# Altium schematic sheet HC-NBIOT_Single_lamp_controller-V1.1.SchDoc
size A2
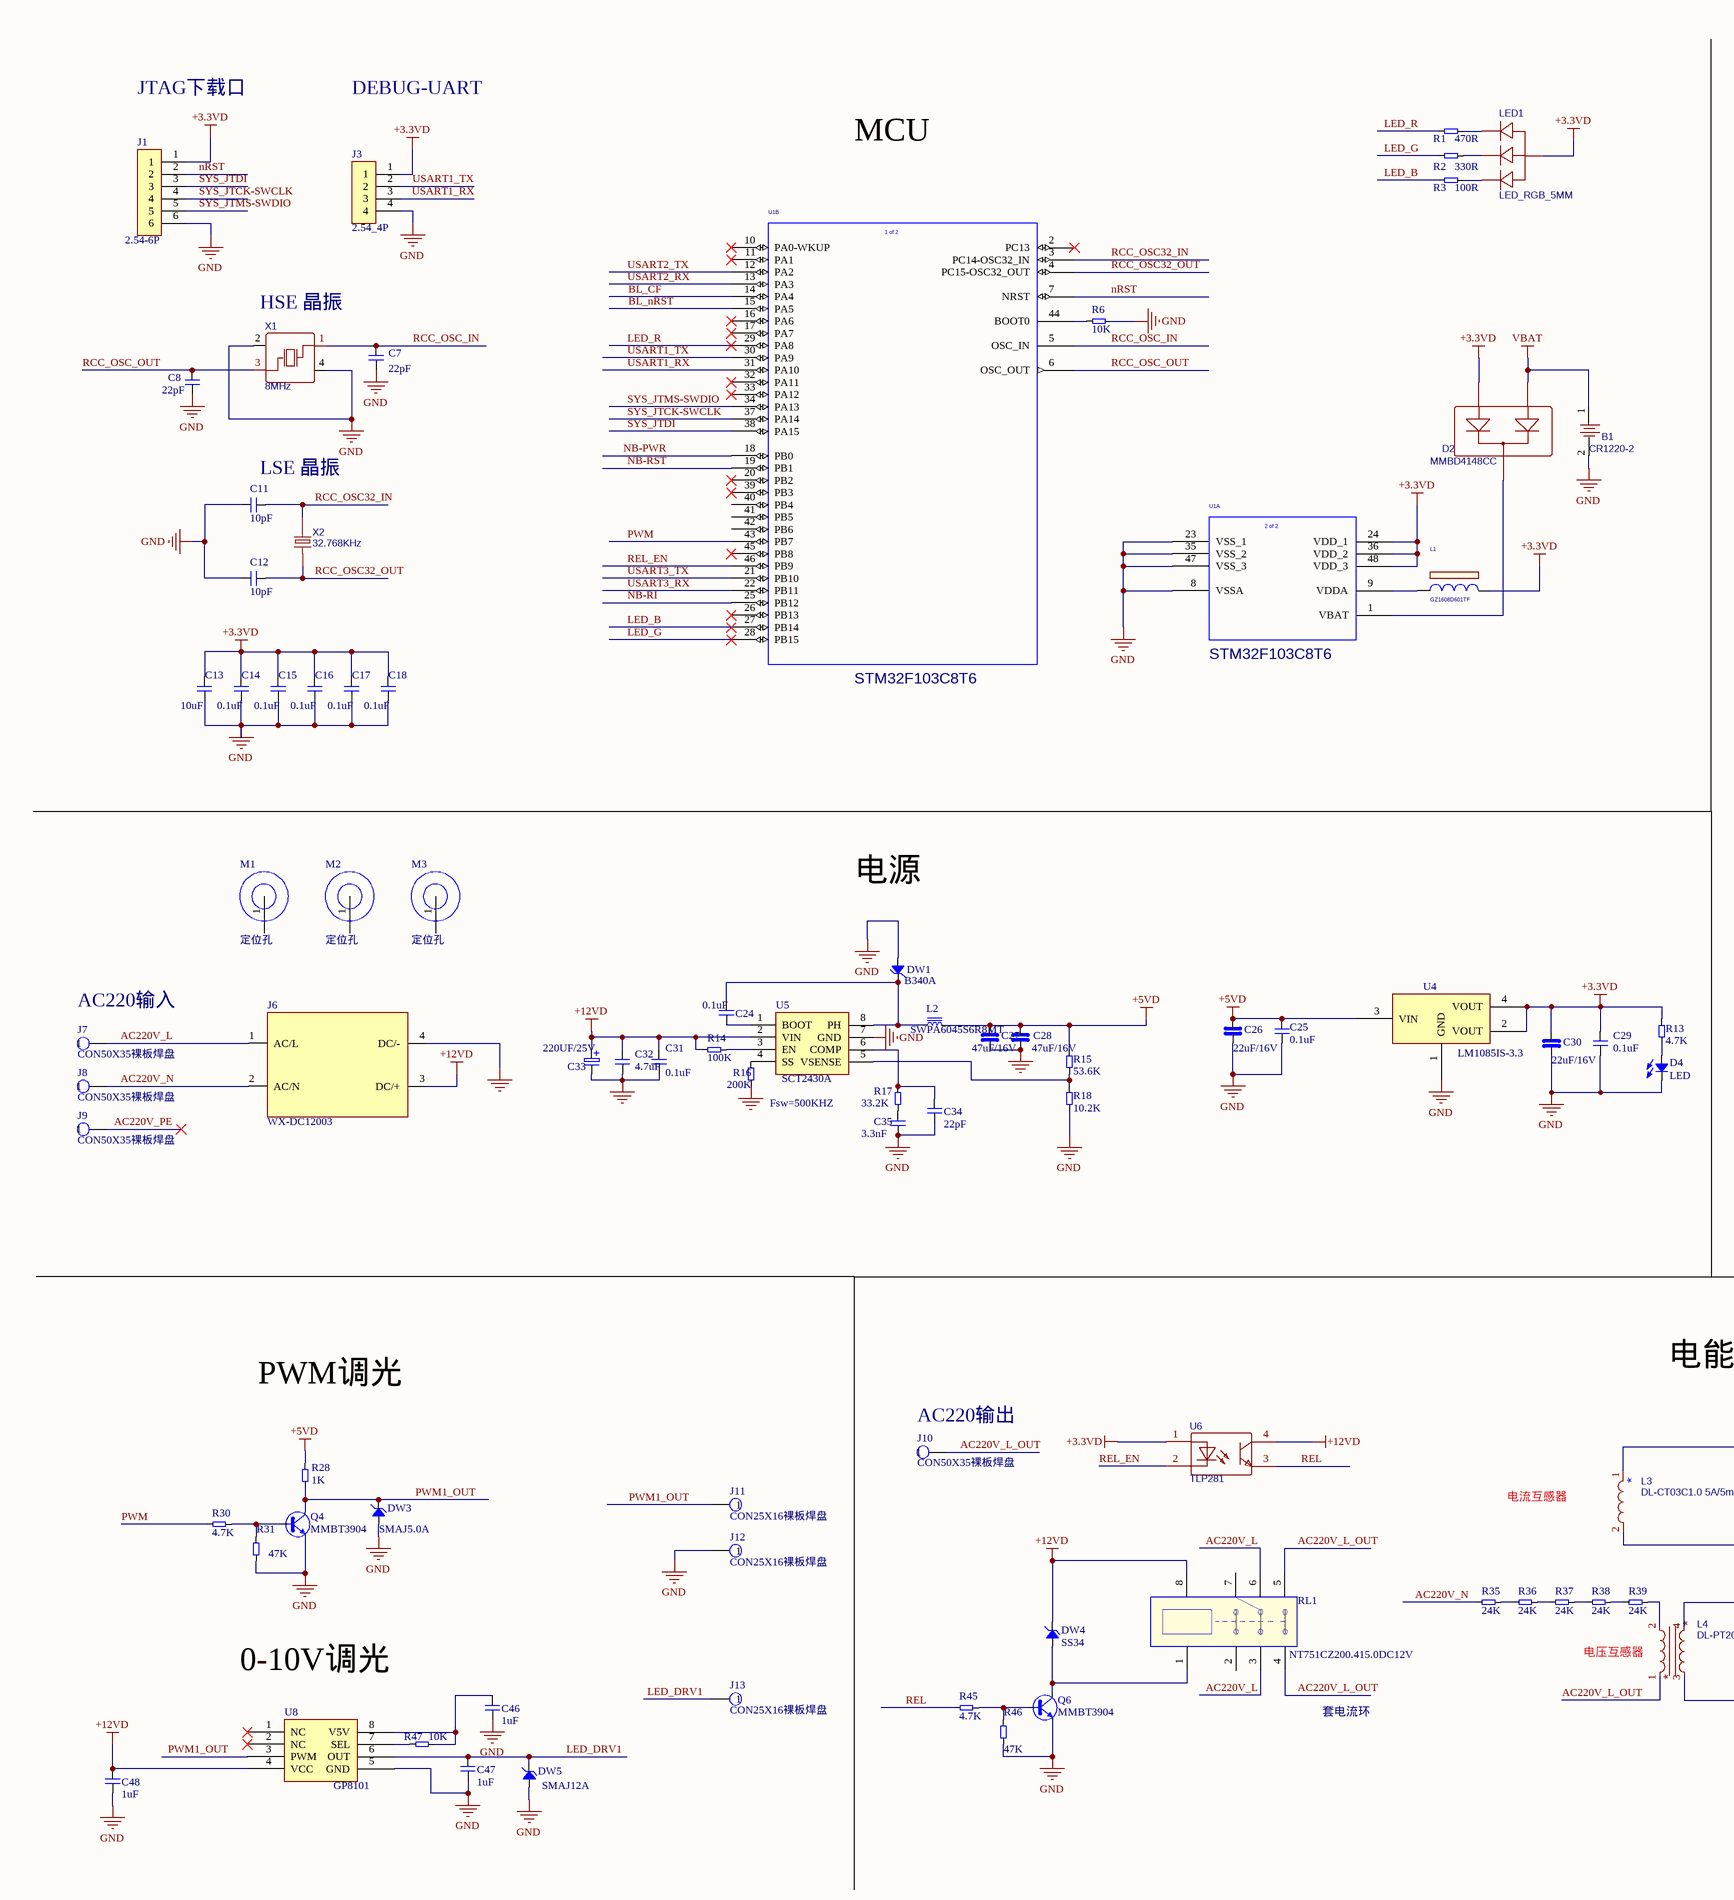
[diagram p0: HC-NBIOT_Single_lamp_controller-V1.1.SchDoc, left]
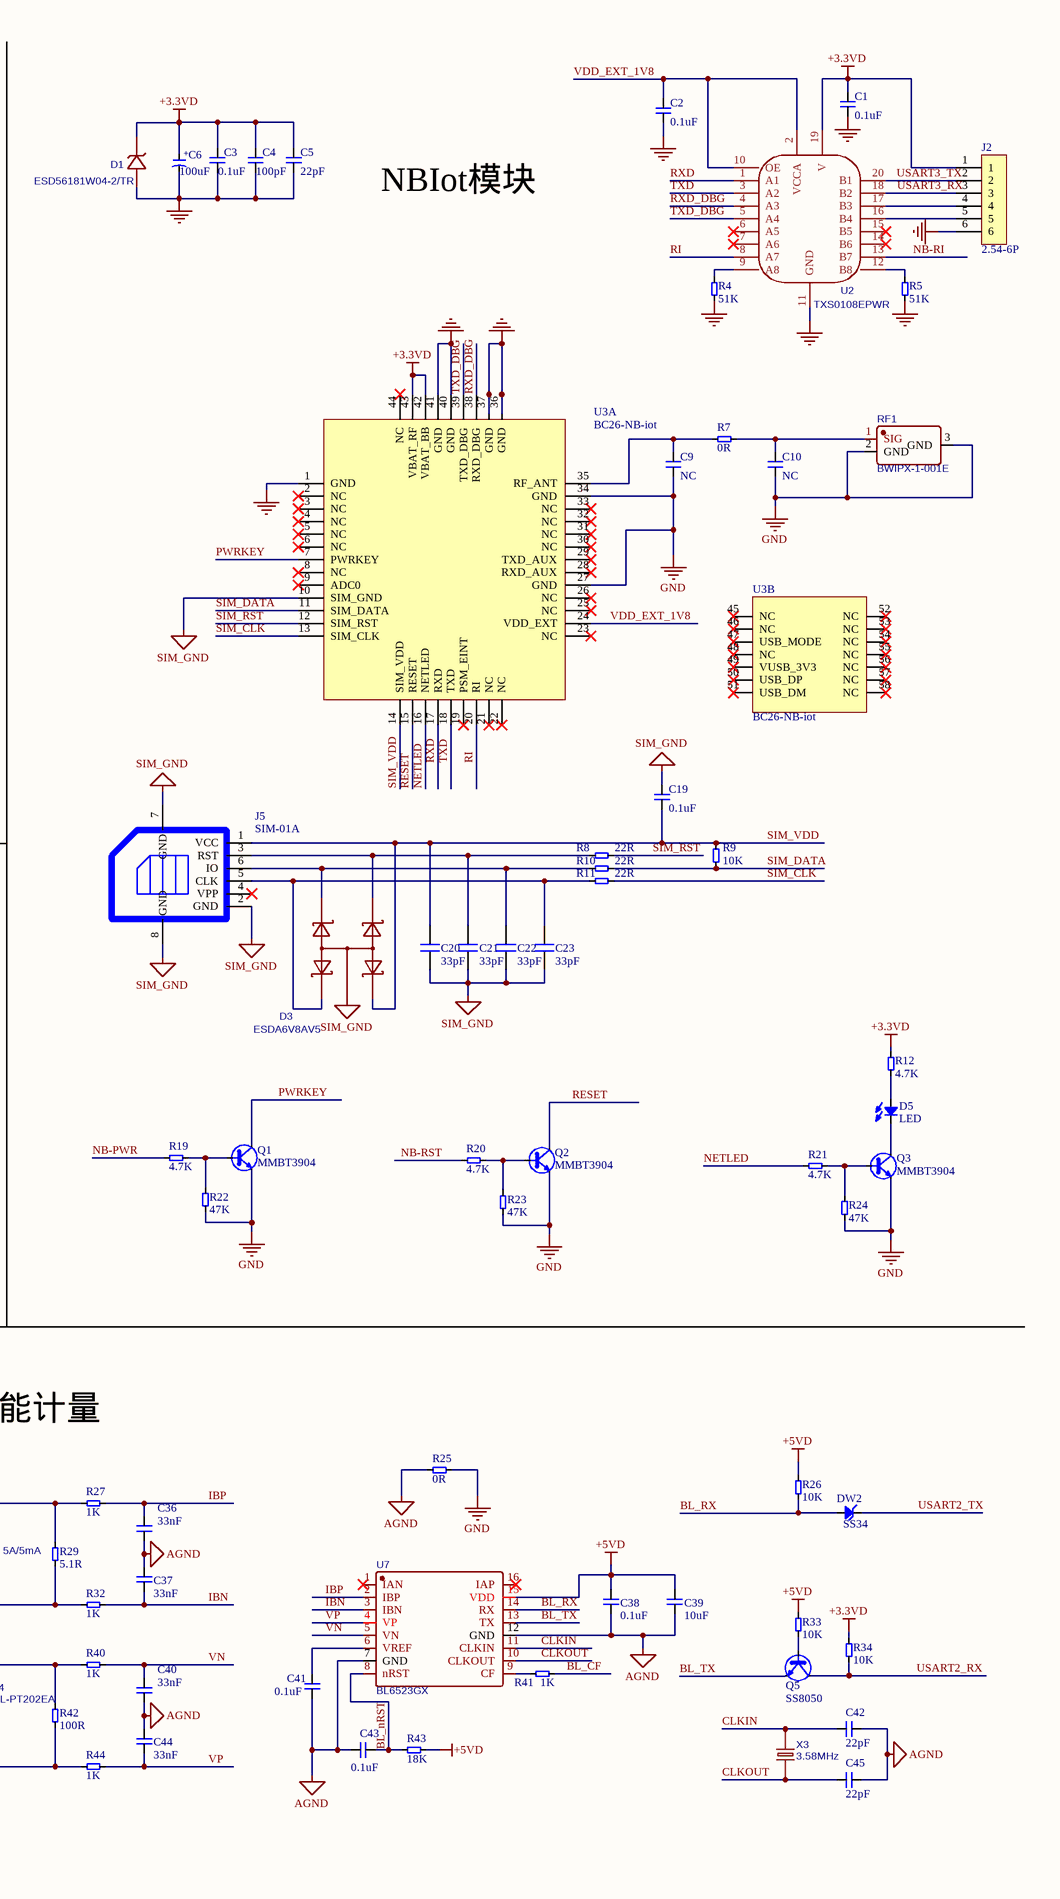
[diagram p1: HC-NBIOT_Single_lamp_controller-V1.1.SchDoc, right]

## Parts
B1  CR1220-2  [BAT-SMD_CR1220-2]
C1  0.1uF  [0603C]
C2  0.1uF  [0603C]
C3  0.1uF  [0603C]
C4  100pF  [0603C]
C5  22pF  [0603C]
C6  100uF  [CAP-SMD_L3.5-W2.8]
C7  22pF  [0603C]
C8  22pF  [0603C]
C9  NC  [0603C]
C10  NC  [0603C]
C11  10pF  [0603C]
C12  10pF  [0603C]
C13  10uF  [1206C]
C14  0.1uF  [0603C]
C15  0.1uF  [0603C]
C16  0.1uF  [0603C]
C17  0.1uF  [0603C]
C18  0.1uF  [0603C]
C19  0.1uF  [0603C]
C20  33pF  [0603C]
C21  33pF  [0603C]
C22  33pF  [0603C]
C23  33pF  [0603C]
C24  0.1uF  [0603C]
C25  0.1uF  [0603C]
C26  22uF/16V  [1206C]
C27  47uF/16V  [1206C]
C28  47uF/16V  [1206C]
C29  0.1uF  [0603C]
C30  22uF/16V  [1206C]
C31  0.1uF  [0603C]
C32  4.7uF  [0603C]
C33  220UF/25V  [RAD-3R8]
C34  22pF  [0603C]
C35  3.3nF  [0603C]
C36  33nF  [0603C]
C37  33nF  [0603C]
C38  0.1uF  [0603C]
C39  10uF  [1206C]
C40  33nF  [0603C]
C41  0.1uF  [0603C]
C42  22pF  [0603C]
C43  0.1uF  [0603C]
C44  33nF  [0603C]
C45  22pF  [0603C]
C46  1uF  [0603C]
C47  1uF  [0603C]
C48  1uF  [0603C]
D1  ESD56181W04-2/TR  [ESD56181W04]
D2  MMBD4148CC  [SOT-23-3]
D3  ESDA6V8AV5  [SOT-553_ESDA6V8AV5]
D4  LED  [LED0603]
D5  LED  [LED0603]
DW1  B340A  [SMB]
DW2  SS34  [SMA]
DW3  SMAJ5.0A  [SMA]
DW4  SS34  [SMA]
DW5  SMAJ12A  [SMA]
J1  2.54-6P  [2.54-6P]
J2  2.54-6P  [2.54-6P]
J3  2.54_4P  [2.54-4P]
J5  SIM-01A  [SIM-01A]
J6  WX-DC12003  [WX-DC12003]
J7  CON50X35裸板焊盘  [SCREW5030]
J8  CON50X35裸板焊盘  [SCREW5030]
J9  CON50X35裸板焊盘  [SCREW5030]
J10  CON50X35裸板焊盘  [SCREW5030]
J11  CON25X16裸板焊盘  [SCREW2516]
J12  CON25X16裸板焊盘  [SCREW2516]
J13  CON25X16裸板焊盘  [SCREW2516]
L1  GZ1608D601TF  [0603L]
L2  SWPA6045S6R8MT  [SDRH6D45]
L3  DL-CT03C1.0 5A/5mA  [DL-CT03C1.0 5A/5mA]
L4  DL-PT202EA  [DL-PT202EA]
LED1  LED_RGB_5MM  [LED_RGB_5MM]
M1  定位孔  [SCREW7035]
M2  定位孔  [SCREW7035]
M3  定位孔  [SCREW7035]
Q1  MMBT3904  [SOT-23]
Q2  MMBT3904  [SOT-23]
Q3  MMBT3904  [SOT-23]
Q4  MMBT3904  [SOT-23]
Q5  SS8050  [SOT-23]
Q6  MMBT3904  [SOT-23]
R1  470R  [0603R]
R2  330R  [0603R]
R3  100R  [0603R]
R4  51K  [0603R]
R5  51K  [0603R]
R6  10K  [0603R]
R7  0R  [0603R]
R8  22R  [0603R]
R9  10K  [0603R]
R10  22R  [0603R]
R11  22R  [0603R]
R12  4.7K  [0603R]
R13  4.7K  [0603R]
R14  100K  [0603R]
R15  53.6K  [0603R]
R16  200K  [0603R]
R17  33.2K  [0603R]
R18  10.2K  [0603R]
R19  4.7K  [0603R]
R20  4.7K  [0603R]
R21  4.7K  [0603R]
R22  47K  [0603R]
R23  47K  [0603R]
R24  47K  [0603R]
R25  0R  [0603R]
R26  10K  [0603R]
R27  1K  [0603R]
R28  1K  [0603R]
R29  5.1R  [0603R]
R30  4.7K  [0603R]
R31  47K  [0603R]
R32  1K  [0603R]
R33  10K  [0603R]
R34  10K  [0603R]
R35  24K  [0603R]
R36  24K  [0603R]
R37  24K  [0603R]
R38  24K  [0603R]
R39  24K  [0603R]
R40  1K  [0603R]
R41  1K  [0603R]
R42  100R  [0603R]
R43  18K  [0603R]
R44  1K  [0603R]
R45  4.7K  [0603R]
R46  47K  [0603R]
R47  10K  [0603R]
RF1  BWIPX-1-001E  [IPEX一代天线座]
RL1  NT751CZ200.415.0DC12V  [G2R-2-24VDC]
U1  STM32F103C8T6  [STM32F103C8T6]  (parts A,B of 2)
U2  TXS0108EPWR  [TXS0108EPWR]
U3  BC26-NB-iot  [BC26]  (parts A,B of 2)
U4  LM1085IS-3.3  [TO-263-3]
U5  SCT2430A  [SOIC8EP-1,27]
U6  TLP281  [SMD-4]
U7  BL6523GX  [SOP-16_BL6523GX]
U8  GP8101  [SOIC8-1,27]
X1  8MHz  [OSC-SMD_4P-25M]
X2  32.768KHz  [OSC-SMD_2P-32.768K]
X3  3.58MHz  [HC-49SMD_3.58M]

## Nets
+3.3VD: C1.1 C3.1 C4.1 C5.1 C6.1 C13.2 C14.2 C15.2 C16.2 C17.2 C18.2 C29.2 C30.1 D1.1(K) D2.2 J1.1 J2.1 J3.1 L1.2 LED1.2(+) R12.2 R13.1 R34.1 U1.24(VDD_1) U1.36(VDD_2) U1.48(VDD_3) U2.19(V) U3.42(VBAT_BB) U3.43(VBAT_RF) U4.2(VOUT) U4.4(VOUT) U6.1
+5VD: C25.1 C26.1 C27.1 C28.1 C38.2 C39.2 L2.2 R15.2 R26.1 R28.2 R33.1 R43.1 U4.3(VIN) U7.15(VDD)
+12VD: C31.2 C32.2 C33.1 C48.2 DW4.K J6.3(DC/+) R14.2 RL1.8 U5.2(VIN) U6.4 U8.4(VCC)
AGND: C36.1 C37.1 C38.1 C39.1 C40.1 C41.1 C42.1 C43.2 C44.1 C45.1 R25.1 U7.7(GND) U7.12(GND)
GND: B1.2 C1.2 C2.2 C3.2 C4.2 C5.2 C6.2 C7.1 C8.1 C9.2 C10.2 C11.2 C12.2 C13.1 C14.1 C15.1 C16.1 C17.1 C18.1 C25.2 C26.2 C27.2 C28.2 C29.1 C30.2 C31.1 C32.1 C33.2 C34.1 C35.1 C46.1 C47.1 C48.1 D1.2(A) D4.1 DW1.A DW3.A DW5.A J1.6 J2.6 J3.4 J6.4(DC/-) J12.1 Q1.2 Q2.2 Q3.2 Q4.2 Q6.2 R4.1 R5.1 R6.1 R16.1 R18.1 R22.1 R23.1 R24.1 R25.2 R31.1 R46.1 RF1.2(GND) RF1.3(GND) U1.8(VSSA) U1.23(VSS_1) U1.35(VSS_2) U1.47(VSS_3) U2.11(GND) U3.1(GND) U3.27(GND) U3.34(GND) U3.36(GND) U3.37(GND) U3.40(GND) U3.41(GND) U4.1(GND) U5.7(GND) U8.5(GND) X1.2(GND) X1.4(GND)
SIM_GND: C19.1 C20.1 C21.1 C22.1 C23.1 D3.2(GND) J5.2(GND) J5.7(GND) J5.8(GND) U3.10(SIM_GND)
VBAT: B1.1 D2.1
AC220V_L: J6.1(AC/L) J7.1 RL1.3 RL1.6
AC220V_L_OUT: J10.1 L4.1 RL1.4 RL1.5
AC220V_N: J6.2(AC/N) J8.1 R35.2
AC220V_PE: J9.1
BL_CF: R41.2 U1.14(PA4)
BL_nRST: C43.1 R43.2 U1.15(PA5) U7.8(nRST)
BL_RX: DW2.A R26.2 U7.14(RX)
BL_TX: Q5.2 U7.13(TX)
CLKIN: C42.2 U7.11(CLKIN) X3.2
CLKOUT: C45.2 U7.10(CLKOUT) X3.1
IBN: C37.2 R32.1 U7.3(IBN)
IBP: C36.2 R27.1 U7.2(IBP)
LED_B: R3.2 U1.27(PB14)
LED_DRV1: C47.2 DW5.K J13.1 U8.6(OUT)
LED_G: R2.2 U1.28(PB15)
LED_R: R1.2 U1.29(PA8)
NB-PWR: R19.1 U1.18(PB0)
NB-RI: U1.25(PB12) U2.13(B7)
NB-RST: R20.1 U1.19(PB1)
NETLED: R21.1 U3.16(NETLED)
nRST: J1.2 U1.7(NRST)
PWM: R30.2 U1.43(PB7)
PWM1_OUT: DW3.K J11.1 Q4.3 R28.1 U8.3(PWM)
PWRKEY: Q1.3 U3.7(PWRKEY)
RCC_OSC32_IN: C11.1 U1.3(PC14-OSC32_IN) X2.2
RCC_OSC32_OUT: C12.1 U1.4(PC15-OSC32_OUT) X2.1
RCC_OSC_IN: C7.2 U1.5(OSC_IN) X1.1(OSC1)
RCC_OSC_OUT: C8.2 U1.6(OSC_OUT) X1.3(OSC2)
REL: R45.1 U6.3
REL_EN: U1.46(PB9) U6.2
RESET: Q2.3 U3.15(RESET)
RI: U2.8(A7) U3.20(RI)
RXD: U2.1(A1) U3.17(RXD)
RXD_DBG: U2.4(A3) U3.38(RXD_DBG)
SIM_CLK: R11.1 U3.13(SIM_CLK)
SIM_DATA: R9.2 R10.1 U3.11(SIM_DATA)
SIM_RST: R8.1 U3.12(SIM_RST)
SIM_VDD: C19.2 C20.2 D3.3(I/O2) J5.1(VCC) R9.1 U3.14(SIM_VDD)
SYS_JTCK-SWCLK: J1.4 U1.37(PA14)
SYS_JTDI: J1.3 U1.38(PA15)
SYS_JTMS-SWDIO: J1.5 U1.34(PA13)
TXD: U2.3(A2) U3.18(TXD)
TXD_DBG: U2.5(A4) U3.39(TXD_DBG)
USART1_RX: J3.3 U1.31(PA10)
USART1_TX: J3.2 U1.30(PA9)
USART2_RX: Q5.3 R34.2 U1.13(PA3)
USART2_TX: DW2.K U1.12(PA2)
USART3_RX: J2.3 U1.22(PB11) U2.18(B2)
USART3_TX: J2.2 U1.21(PB10) U2.20(B1)
VDD_EXT_1V8: C2.1 U2.2(VCCA) U2.10(OE) U3.24(VDD_EXT)
VN: C40.2 R40.1 U7.5(VN)
VP: C44.2 R44.1 U7.4(VP)
NetC9_1: C9.1 R7.2 U3.35(RF_ANT)
NetC10_1: C10.1 R7.1 RF1.1(SIG)
NetC21_2: C21.2 D3.4(I/O3) J5.3(RST) R8.2
NetC22_2: C22.2 D3.5(I/O4) J5.6(IO) R10.2
NetC23_2: C23.2 D3.1(I/O1) J5.5(CLK) R11.2
NetC24_1: C24.1 U5.1(BOOT)
NetC24_2: C24.2 DW1.K L2.1 U5.8(PH)
NetC34_2: C34.2 R17.2 U5.6(COMP)
NetC35_2: C35.2 R17.1
NetC41_2: C41.2 U7.6(VREF)
NetC46_2: C46.2 R47.2 U8.8(V5V)
NetD2_3: D2.3 U1.1(VBAT)
NetD4_2: D4.2 R13.2
NetD5_1: D5.1 Q3.3
NetD5_2: D5.2 R12.1
NetDW4_A: DW4.A Q6.3 RL1.1
NetJ2_4: J2.4 U2.17(B3)
NetJ2_5: J2.5 U2.16(B4)
NetL1_1: L1.1 U1.9(VDDA)
NetL3_1: L3.1 R27.2 R29.2
NetL3_2: L3.2 R29.1 R32.2
NetL4_2: L4.2 R39.1
NetL4_3: L4.3 R42.1 R44.2
NetL4_4: L4.4 R40.2 R42.2
NetLED1_1: LED1.1(-) R1.1
NetLED1_3: LED1.3(-) R2.1
NetLED1_4: LED1.4(-) R3.1
NetQ1_1: Q1.1 R19.2 R22.2
NetQ2_1: Q2.1 R20.2 R23.2
NetQ3_1: Q3.1 R21.2 R24.2
NetQ4_1: Q4.1 R30.1 R31.2
NetQ5_1: Q5.1 R33.2
NetQ6_1: Q6.1 R45.2 R46.2
NetR4_2: R4.2 U2.9(A8)
NetR5_2: R5.2 U2.12(B8)
NetR6_2: R6.2 U1.44(BOOT0)
NetR14_1: R14.1 U5.3(EN)
NetR15_1: R15.1 R18.2 U5.5(VSENSE)
NetR16_2: R16.2 U5.4(SS)
NetR35_1: R35.1 R36.2
NetR36_1: R36.1 R37.2
NetR37_1: R37.1 R38.2
NetR38_1: R38.1 R39.2
NetR41_1: R41.1 U7.9(CF)
NetR47_1: R47.1 U8.7(SEL)

Not connected (* = marked no-connect by the designer): J5 4(VPP)*; M1 1; M2 1; M3 1; RL1 2 7; U1 2(PC13)* 10(PA0-WKUP)* 11(PA1)* 16(PA6)* 17(PA7)* 20(PB2)* 26(PB13)* 32(PA11)* 33(PA12)* 39(PB3)* 40(PB4) 41(PB5) 42(PB6) 45(PB8)*; U2 6(A5)* 7(A6)* 14(B6)* 15(B5)*; U3 2(NC)* 3(NC)* 4(NC)* 5(NC)* 6(NC)* 8(NC)* 9(ADC0)* 19(PSM_EINT)* 21(NC)* 22(NC)* 23(NC)* 25(NC)* 26(NC)* 28(RXD_AUX)* 29(TXD_AUX)* 30(NC)* 31(NC)* 32(NC)* 33(NC)* 44(NC)* 45(NC)* 46(NC)* 47(USB_MODE)* 48(NC)* 49(VUSB_3V3)* 50(USB_DP)* 51(USB_DM)* 52(NC)* 53(NC)* 54(NC)* 55(NC)* 56(NC)* 57(NC)* 58(NC)*; U7 1(IAN)* 16(IAP)*; U8 1(NC)* 2(NC)*

## Notes on the sheet
- JTAG下载口
- DEBUG-UART
- MCU
- NBIot模块
- (near X1) HSE 晶振
- (near C11) LSE 晶振
- 电源
- (near J7) AC220输入
- Fsw=500KHZ
- PWM调光
- 电能计量
- (near J10) AC220输出
- 电流互感器
- 0-10V调光
- 电压互感器
- 套电流环
- Title
- Size:
- Date:
- File:
- A2
- Number:
- Time:
- Revision:
- Sheet
- of
- (in symbol Capacitor) +
- (in symbol STM32F103C8T6, part A) 2 of 2
- (in symbol STM32F103C8T6, part B) 1 of 2

## Library data of the parts
B1 = CR1220-2: BOM_Manufacturer: Q&J; BOM_Supplier: LCSC; BOM_Manufacturer Part: CR1220-2; image: //image.lceda.cn/szlcsc/C70381.jpg; BOM_Supplier Part: C70381; spicePre: B; spiceSymbolName: CR1220-2
C1-C5 C7-C19 C24 C25 C29 C31 C32 C34-C48 = 电容
C6 = Capacitor: 电解电容
C20-C23 = CAP: 电容
C26-C28 C30 = 多层陶瓷电容
C33 = 直插电解电容: 电解电容
D1 = TVS二极管: BOM_Manufacturer: WILLSEMI(Will Semicon); Contributor: LCSC; BOM_Supplier: LCSC; BOM_Supplier Part: C910982; BOM_Manufacturer Part: ESD56181W04-2/TR; spicePre: D; spiceSymbolName: ESD56181W04-2/TR
D2 = MMBD4148CC: BOM_Manufacturer: CJ; SMT Type: Extend; BOM_Supplier: LCSC; BOM_Manufacturer Part: MMBD4148CC; image: //image.lceda.cn/szlcsc/C8595.jpg; BOM_Supplier Part: C8595; BOM_LCSC Assembly: Yes; spicePre: D; spiceSymbolName: MMBD4148CC_C8595
D3 = ESDA6V8AV5: BOM_Manufacturer: Will Semicon; Contributor: LCSC; BOM_Paste Type: expand; BOM_Assembly Type: smtWeld; BOM_Supplier: LCSC; BOM_Supplier Part: C268741; BOM_Manufacturer Part: ESDA6V8AV5; spicePre: D; spiceSymbolName: ESDA6V8AV5
D4 D5 = 发光二极管
DW1-DW5 = 肖特基二极管
J1 J2 = PIN_6P
J3 = PIN_4P
J5 = SIM-01A: SIM卡座
J7-J13 = CON1X1
L1 = INDUCTOR_FERRITE: IND FER BEAD 120 OHM@100MHZ 0.5A 25% 0402; PART_TYPE: FERRITE\BEAD; CLASS: DISCRETE; AGILE_PN: 180-77771; MFG_NAME01: Murata; MFG_PN01: BLM15AG121SN1D; CAD_APPROVED: Yes; FPLIST: IND_0402,0402_CC; Tolerance: 25%; ROHS: Yes; HEIGHT: 0.55MM
L2 = 功率电感
L3 = DL-CT03C1.0 5A/5mA: BOM_Manufacturer: ZEMING; BOM_Manufacturer Part: ZMCT102; nameAlias: Value; SMT Type: Extend; BOM_Supplier: LCSC; BOM_Supplier Part: C84213; BOM_JLCPCB SMD: Yes; spicePre: L; spiceSymbolName: ZMCT102
L4 = DL-PT202EA: BOM_Manufacturer: ZEMING; BOM_Manufacturer Part: ZMPT107-1; nameAlias: Value; BOM_Supplier: LCSC; BOM_Supplier Part: C125191; spicePre: L; spiceSymbolName: ZMPT107-1
LED1 = LED_REB_5MM: BOM_Manufacturer: MEIHUA; BOM_Manufacturer Part: MHLA5319URGBDWT; Contributor: LCSC; SMT Type: Extend; BOM_Supplier: LCSC; BOM_Supplier Part: C417349; BOM_JLCPCB SMD: Yes; spicePre: L; spiceSymbolName: MHLA5319URGBDWT
Q5 = MMBT3904
R1-R3 R6 R13 R17 = 电阻
R4 R5 R7-R12 R14-R16 R18-R47 = 电阻: Text Field1: 111-XXXX003-010-1; Text Field2: 111-XXXX005-010-1; Text Field3: 111-XXXX006-010-1
RF1 = IPEX一代天线座: BOM_Manufacturer: BAT WIRELESS(蝙蝠无线); Contributor: LCSC; BOM_Paste Type: expand; BOM_Assembly Type: smtWeld; BOM_Supplier: LCSC; BOM_Supplier Part: C496552; BOM_Manufacturer Part: BWIPX-1-001E; spicePre: R; spiceSymbolName: BWIPX-1-001E
RL1 = Relay-SPDT: Relay; Published: 24-Mar-1999; LatestRevisionDate: 17-Jul-2002; LatestRevisionNote: Re-released for DXP Platform.; PackageReference: DIP-P8; Publisher: Altium Limited; PackageDescription: Relay; 8 Leads
U1 = STM32F103C8T6: Manufacturer_Part_Number: stm32f103cxt2; Designator: 2; Vendor: STMicroelectronics; OriginalSymbolOrigin: (30000,20000); PackageName: stm32f103cxt2; Copyright: Copyright (C) 2016 Accelerated Designs. All rights reserved; < Value >: STM32F103C8T6
U2 = TXS0108EPWR: BOM_Manufacturer: TI; SMT Type: Extend; BOM_Supplier: LCSC; BOM_Manufacturer Part: TXS0108EPWR; image: //image.lceda.cn/szlcsc/C17206.jpg; BOM_Supplier Part: C17206; BOM_LCSC Assembly: Yes; spicePre: U; spiceSymbolName: TXS0108EPWR
U3 = BC26
U4 = LM1085: 3A Low Dropout Positive Regulators; NS: *
U5 = TPS54331
U6 = TLP281: BOM_Manufacturer: Isocom Components; Contributor: LCSC; BOM_Supplier: LCSC; BOM_Supplier Part: C433437; BOM_Manufacturer Part: TLP281; spicePre: U; spiceSymbolName: TLP281
U7 = BL6523GX: BOM_Manufacturer: Shanghai Belling; Contributor: LCSC; SMT Type: Extend; BOM_Supplier: LCSC; BOM_Supplier Part: C213392; BOM_Manufacturer Part: BL6523GX; BOM_JLCPCB SMD: Yes; spicePre: U; spiceSymbolName: BL6523GX
U8 = GP8101: PWM 2 ANALOG
X1 = TSX-3225 25MHz 20pF 10ppm: BOM_Manufacturer: EPSON; BOM_Manufacturer Part: X1E0000210352000G; nameAlias: Frequency; SMT Type: Extend; BOM_Supplier: LCSC; BOM_Supplier Part: C91738; BOM_LCSC Assembly: Yes; spicePre: X; spiceSymbolName: X1E0000210352000G
X2 X3 = 32.768kHz 20PPM 7pF: BOM_Manufacturer: SEIKO; BOM_Manufacturer Part: SC-32S32.768kHz20PPM7pF; nameAlias: Frequency; BOM_Supplier: LCSC; BOM_Supplier Part: C97604; spicePre: X; spiceSymbolName: SC-32S32.768kHz20PPM7pF